# EAGLE design wire (EAGLE 6.5.0)
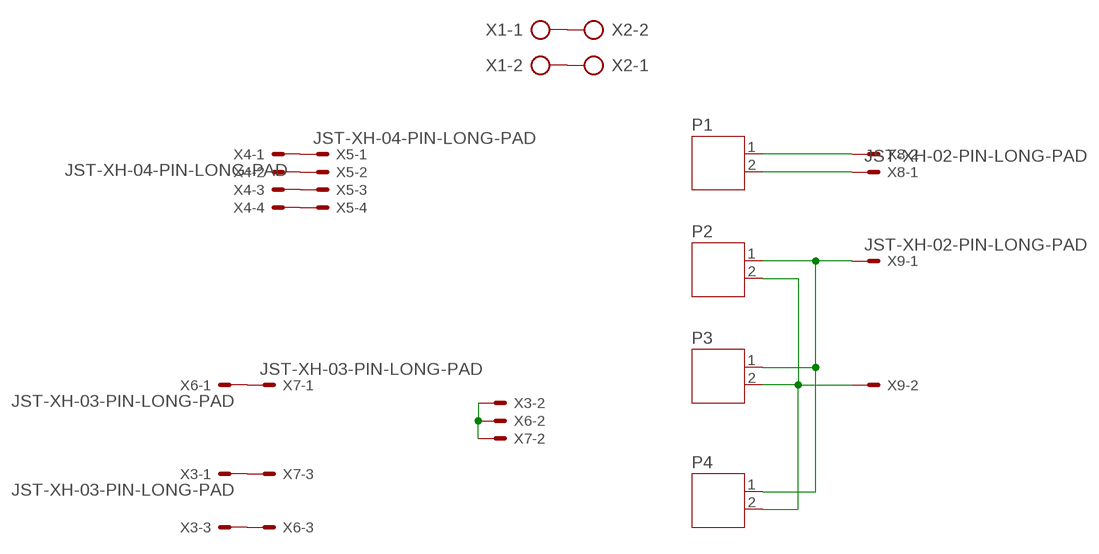
[diagram p0: schematic, sheet 1]

## Parts
P1  JST-PH2  [JST-PH2]
P2  JST-PH2  [JST-PH2]
P3  JST-PH2  [JST-PH2]
P4  JST-PH2  [JST-PH2]
X1  AK500/2  [AK500/2]
X2  AK500/2  [AK500/2]
X3  JST-XH-03-PIN-LONG-PAD  [JST-XH-03-PACKAGE-LONG-PAD]
X4  JST-XH-04-PIN-LONG-PAD  [JST-XH-04-PACKAGE-LONG-PAD]
X5  JST-XH-04-PIN-LONG-PAD  [JST-XH-04-PACKAGE-LONG-PAD]
X6  JST-XH-03-PIN-LONG-PAD  [JST-XH-03-PACKAGE-LONG-PAD]
X7  JST-XH-03-PIN-LONG-PAD  [JST-XH-03-PACKAGE-LONG-PAD]
X8  JST-XH-02-PIN-LONG-PAD  [JST-XH-02-PACKAGE-LONG-PAD]
X9  JST-XH-02-PIN-LONG-PAD  [JST-XH-02-PACKAGE-LONG-PAD]

## Nets
N$1: X4.1 X5.1
N$2: P2.1 P3.1 P4.1 X9.1
N$3: X4.2 X5.2
N$4: X4.3 X5.3
N$5: X4.4 X5.4
N$6: P2.2 P3.2 P4.2 X9.2
N$7: X1.1 X2.2
N$8: X1.2 X2.1
N$11: P1.1 X8.2
N$12: P1.2 X8.1
N$13: X6.1 X7.1
N$14: X3.2 X6.2 X7.2
N$15: X3.1 X7.3
N$16: X3.3 X6.3

## Library data of the parts
P1-P4 = jst-ph:JST-PH2
X1 X2 = con-ptr500:AK500/2: CONNECTOR; OC_FARNELL: unknown; OC_NEWARK: unknown
X3 X6 X7 = Rembrandt Electronics - JST XH Connectors v1-0:JST-XH-03-PIN: JST XH Connector 2 Pin Wire to board connector. Pitch: 2,54 mm, (0.100") Number of pins: 3 Created by Rembrandt Electronics www.rembrandtelectronics.com
X4 X5 = Rembrandt Electronics - JST XH Connectors v1-0:JST-XH-04-PIN: JST XH Connector 2 Pin Wire to board connector. Pitch: 2,54 mm, (0.100") Number of pins: 4 Created by Rembrandt Electronics www.rembrandtelectronics.com
X8 X9 = Rembrandt Electronics - JST XH Connectors v1-0:JST-XH-02-PIN: JST XH Connector 2 Pin Wire to board connector. Pitch: 2,54 mm, (0.100") Number of pins: 2 Created by Rembrandt Electronics www.rembrandtelectronics.com

## Board
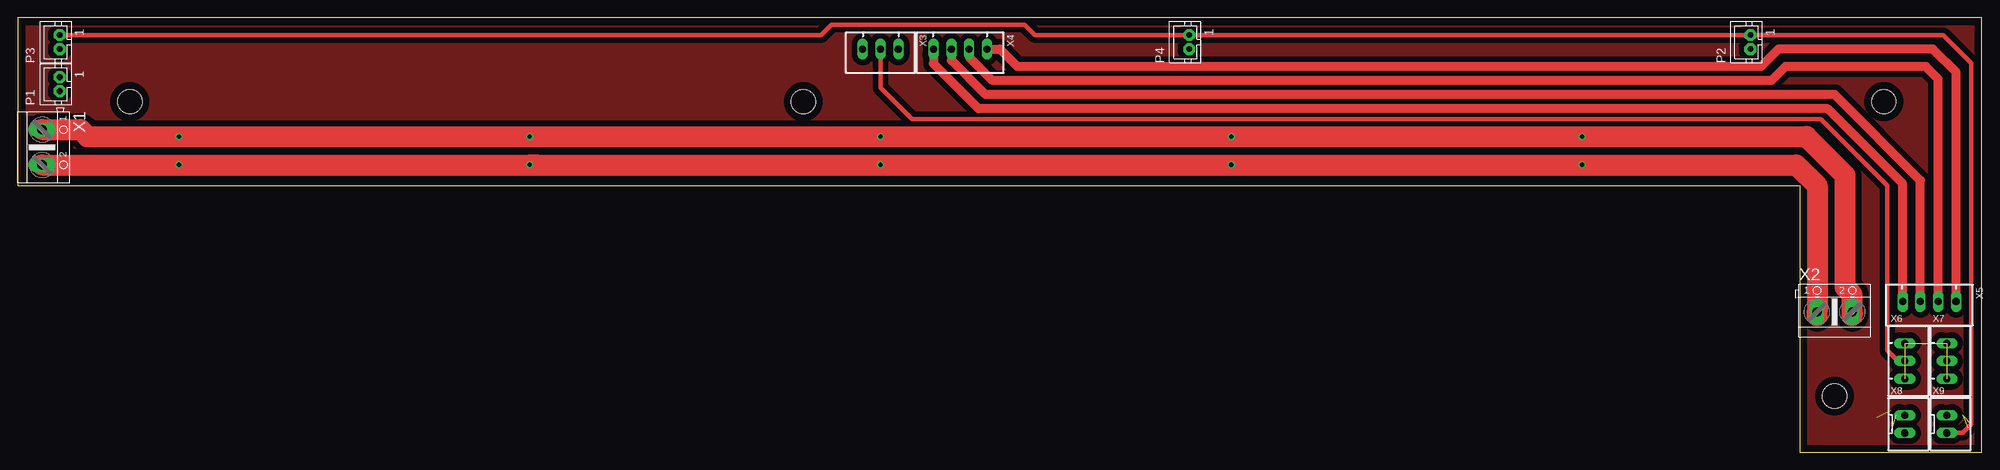
[diagram p1: board, top side]
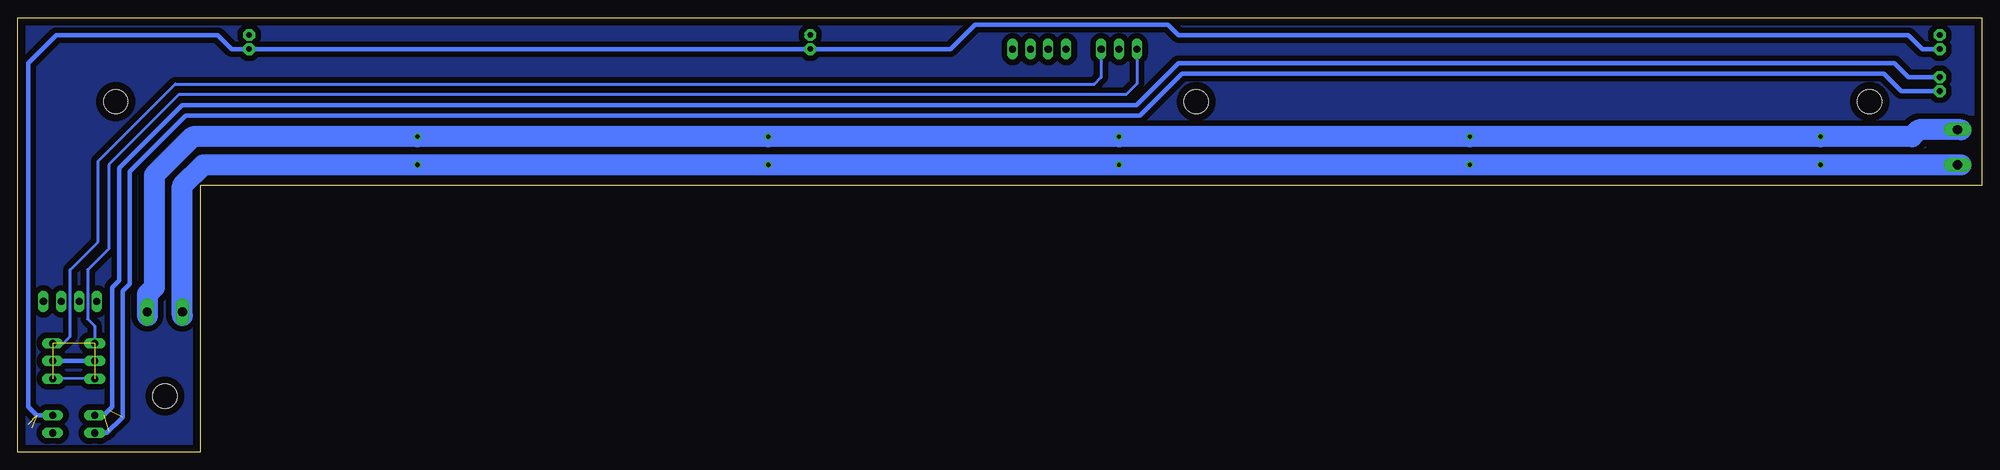
[diagram p2: board, bottom side, seen from below]

Size 280 x 62 mm. Coordinates in mm from the lower left corner, seen from the top.
Outline: 0,38 254,38 254,0 280,0 280,62 0,62 0,38
Copper layers (1*16): Top 0.035mm / dielectric 1.5mm / Bottom 0.035mm
Design rules "default": minimum track width 10mil, minimum drill 24mil, track to track 8mil, track to pad 8mil, pad to pad 8mil, via to via 8mil, smd to smd 8mil, copper to edge 40mil, drill to drill 8mil, minimum pad ring 10mil, minimum via ring 8mil, stop-mask expansion 4mil, vias tented up to drill 0mil, thermal gap 10mil
Holes 3.5 mm at 266,50 16,50 112,50 259,8

### Footprints (pad centres in the part's own frame; a part is rotated, then mirrored left to right if it is on the bottom)
JST-PH2 = drill 0.813 pad 1.676 octagon: 1 1,0; 2 -1,0
AK500/2 = drill 1.321 long: 1 -2.515,0; 2 2.515,0
JST-XH-03-PACKAGE-LONG-PAD = drill 1.016 long: 1 -2.54,0; 2 0,0; 3 2.54,0
JST-XH-04-PACKAGE-LONG-PAD = drill 1.016 long: 1 -3.81,0; 2 -1.27,0; 3 1.27,0; 4 3.81,0
JST-XH-02-PACKAGE-LONG-PAD = drill 1.016 long: 1 -1.27,0; 2 1.27,0

### Placement (x,y rotation side)
P1  6,52.5 90 top
P2  247,58.5 90 top
P3  6,58.5 90 top
P4  167,58.5 90 top
X1  3.5,43.5 270 top
X2  259,20 0 top
X3  123,57.5 180 top
X4  134.37,57.5 180 top
X5  272.5,21.5 180 top
X6  269,13 270 top
X7  275,13 270 top
X8  269,4 270 top
X9  275,4 270 top

### Tracks (layer width: path | path; a pad name or v marks a point on that pad's centre or on a via)
N$1
  Top 1.27: X4.1 140,57.5 142.5,55 248.5,55 251,57.5 273,57.5 276.31,54.19 X5.1
N$2  (1 unrouted)
  Top 0.61: P3.1 114.5,59.5 116,61 143.5,61 145,59.5 P4.1 P2.1 274.5,59.5 278.5,55.5 278.5,4 277.23,2.73
  Bottom 0.61: X9.1 277.27,5.27 278,6
N$3
  Top 1.27: X5.2 273.77,53.23 272,55 252,55 250,53 139,53 135.63,56.36 X4.2
N$4
  Top 1.27: X4.3 133.09,55.91 138,51 259,51 271.23,38.77 X5.3
N$5
  Top 1.27: X4.4 130.56,55.45 137,49 258,49 268.69,38.31 X5.4
N$6  (1 unrouted)
  Top 0.61: X9.2 277.23,2.73 278,3.5
  Bottom 0.61: P3.2 8.5,57.5 10.5,59.5 114.5,59.5 116,61 143.5,61 147,57.5 P4.2 P2.2 249.5,57.5 251.5,59.5 274.5,59.5 278.5,55.5 278.5,6.5 277.27,5.27
N$7
  Top 0.406: 7,46.02 9,46
  Top 3: X1.1 7,46.02 8.98,46.02 9,46 10,45 254.99,45.02 260.51,39.48 260.5,23.5 261.51,22.48 261.51,19.52 261.5,19.5 X2.2
N$8
  Top 3: X1.2 253.51,40.98 256.5,38 256.5,20.02 | 256.5,19.5 256.5,20.02 | 256.5,20.02 X2.1
N$11  (1 unrouted)
  Bottom 0.61: P1.1 10.5,53.5 12.5,55.5 114.5,55.5 120.5,49.5 256.5,49.5 265.5,40.5 265.5,24.5 266.5,23.5 266.5,6.5 267.73,5.27 | X8.2 267.27,2.73 267,3
N$12  (1 unrouted)
  Bottom 0.61: P1.2 11.5,51.5 14,54 114,54 120,48 256,48 264,40 264,24 265,23 265,5 267.27,2.73 | X8.1 267.73,5.27 267,6
N$13  (1 unrouted)
N$14
  Top 0.61: X3.2 123,52 127.5,47.5 257,47.5 266.5,38 266.5,14.5 268,13 X6.2
  Bottom 0.61: X6.2 X7.2
N$15  (1 unrouted)
  Bottom 0.406: X3.1 125.54,53.46 126.5,52.5 257.5,52.5 268.5,41.5 268.5,30 272.5,26 272.5,16.5 273.5,15.5 275,15.5
N$16  (1 unrouted)
  Bottom 0.406: X3.3 120.46,52.54 122,51 257,51 267,41 267,29 270,26 270,19 269,18 269,15.5 | X6.3 275,10.5
N$17  (via drill 0.6)
  Bottom 3: 3,46 9,46 10,45 v23,45 v73,45 v123,45 v173,45 v223,45 255,45 260.5,39.5 260.5,23.5 261.5,22.5 261.5,19.5
N$18  (via drill 0.6)
  Bottom 3: 256.5,19.5 256.5,38 253.5,41 v223,41 v173,41 v123,41 v73,41 v23,41 3,41
N$19
  Top 3: 73,41 74,41
N$20
  pour Top (isolate 0.813): 1,61 1,48 8,48 8,39 254,39 254,1 279,1 279,61
N$21
  pour Bottom (isolate 0.813): 1,61 1,48 8,48 8,39 254,39 254,1 279,1 279,61

### Text on the board
tOrigins: Cooling Fan | Cooling Fan | X/Z End Stop | X motor | Temp Sensor | TinyBoy2 (L16) Wire Board | Heater | Heater | X motor | Z min | X max | Fan | Temp